# Altium schematic sheet [02] - BLOCK DIAGRAM.SchDoc
size A3; DocumentNumber: 2; SheetNumber: 2; SheetTotal: 8
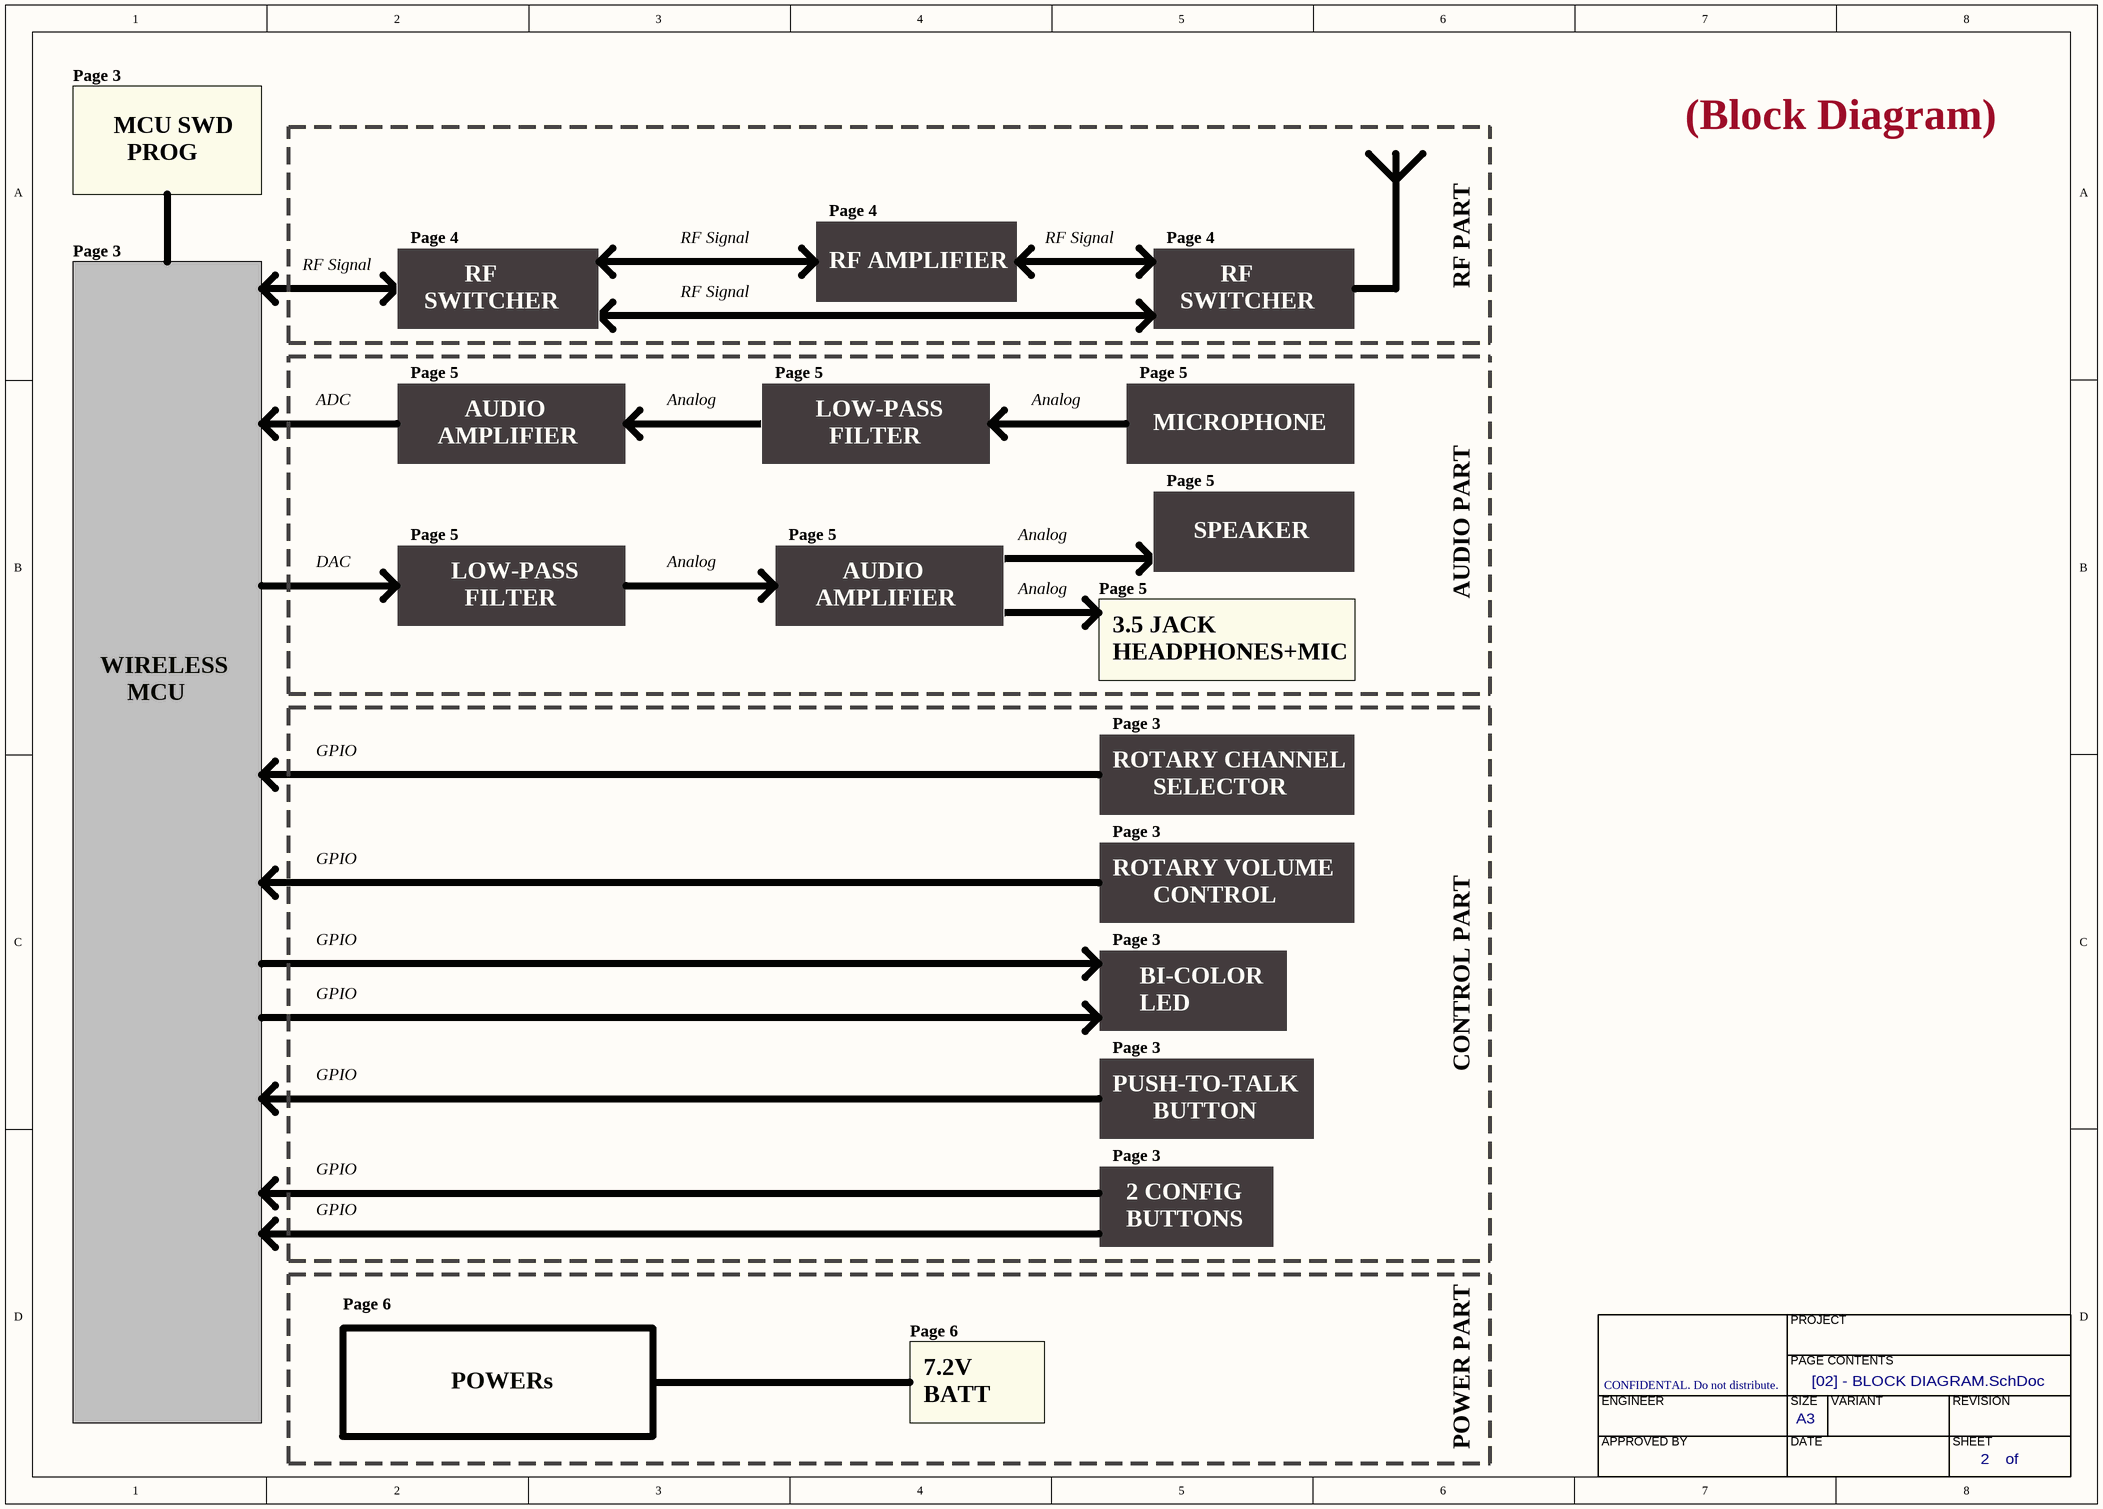
[diagram p0: [02] - BLOCK DIAGRAM.SchDoc]

## Notes on the sheet
- Page 3
- MCU SWD
- PROG
- (Block Diagram)
- Page 4
- RF Signal
- SWITCHER
- RF
- RF AMPLIFIER
- RF PART
- Page 5
- ADC
- AMPLIFIER
- AUDIO
- Analog
- LOW-PASS
- FILTER
- MICROPHONE
- DAC
- SPEAKER
- 3.5 JACK
- AUDIO PART
- WIRELESS
- MCU
- HEADPHONES+MIC
- GPIO
- ROTARY CHANNEL
- SELECTOR
- ROTARY VOLUME
- CONTROL
- BI-COLOR
- LED
- PUSH-TO-TALK
- BUTTON
- CONTROL PART
- 2 CONFIG
- BUTTONS
- Page 6
- PROJECT
- POWERs
- 7.2V
- CONFIDENTAL. Do not distribute.
- PAGE CONTENTS
- BATT
- POWER PART
- ENGINEER
- APPROVED BY
- SIZE
- DATE
- A3
- VARIANT
- REVISION
- SHEET
- of